# Altium schematic sheet Sensing - Voltage.SchDoc: [12] Sensing - Voltage
size A4; ApprovedBy: Nagy Richard; CheckedBy: Nagy Richard; Author: Nagy Richard; CompanyName: EmbedCore; DrawnBy: Nagy Richard; Engineer: Nagy Richard; Organization: EmbedCore; DocumentNumber: 10; Revision: 1.0; SheetNumber: 12; SheetTotal: 13
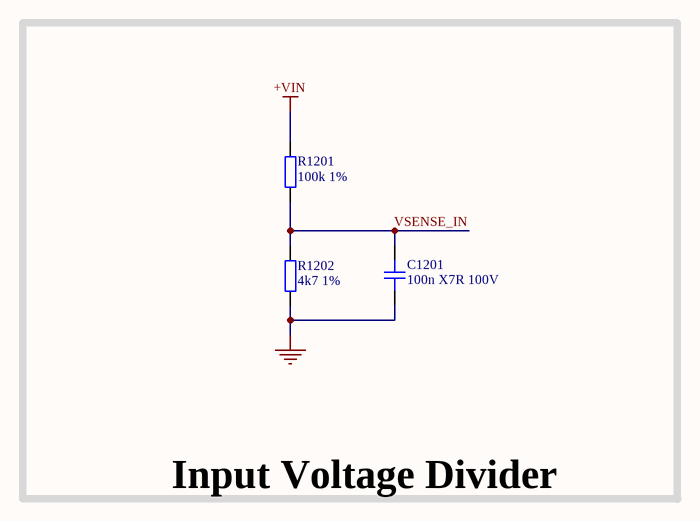
[diagram p0: Sensing - Voltage.SchDoc]

## Parts
C1201  100n X7R 100V  [CAP_0603]
R1201  100k 1%  [RES_0603]
R1202  4k7 1%  [RES_0603]

## Blocks framed on the sheet
Input Voltage Divider: C1201 R1201 R1202

## Nets
+VIN: R1201.2
GND: C1201.1 R1202.1
VSENSE_IN: C1201.2 R1201.1 R1202.2

## Notes on the sheet
- Title:
- Drawn By:
- Page Contents:
- Checked By:
- Size:
- Date:
- File:
- License:
- Email:
- A4
- Number:
- Time:
- Revision:
- Sheet
- Website:
- of

## Library data of the parts
C1201 = CAP_0603: Capacitor SMD 0603; Manufacturer: CCTC; Manufacturer Part Number: TCC0603X7R104K101CT; Distributor Link: www.lcsc.com; LCSC: C696916; Rating: *; Dielectric: *
R1201 = RES_0603: Resistor SMD 0603; Manufacturer: Vishay Intertech; Manufacturer Part Number: MCT06030C1003FP500; Distributor Link: www.lcsc.com; LCSC: C161805
R1202 = RES_0603: Resistor SMD 0603; Manufacturer: Vishay Intertech; Manufacturer Part Number: TNPW06034K70BEEA; Distributor Link: www.lcsc.com; LCSC: C844460